# Altium schematic sheet Sh_Inputs_Analog.SchDoc
size A3
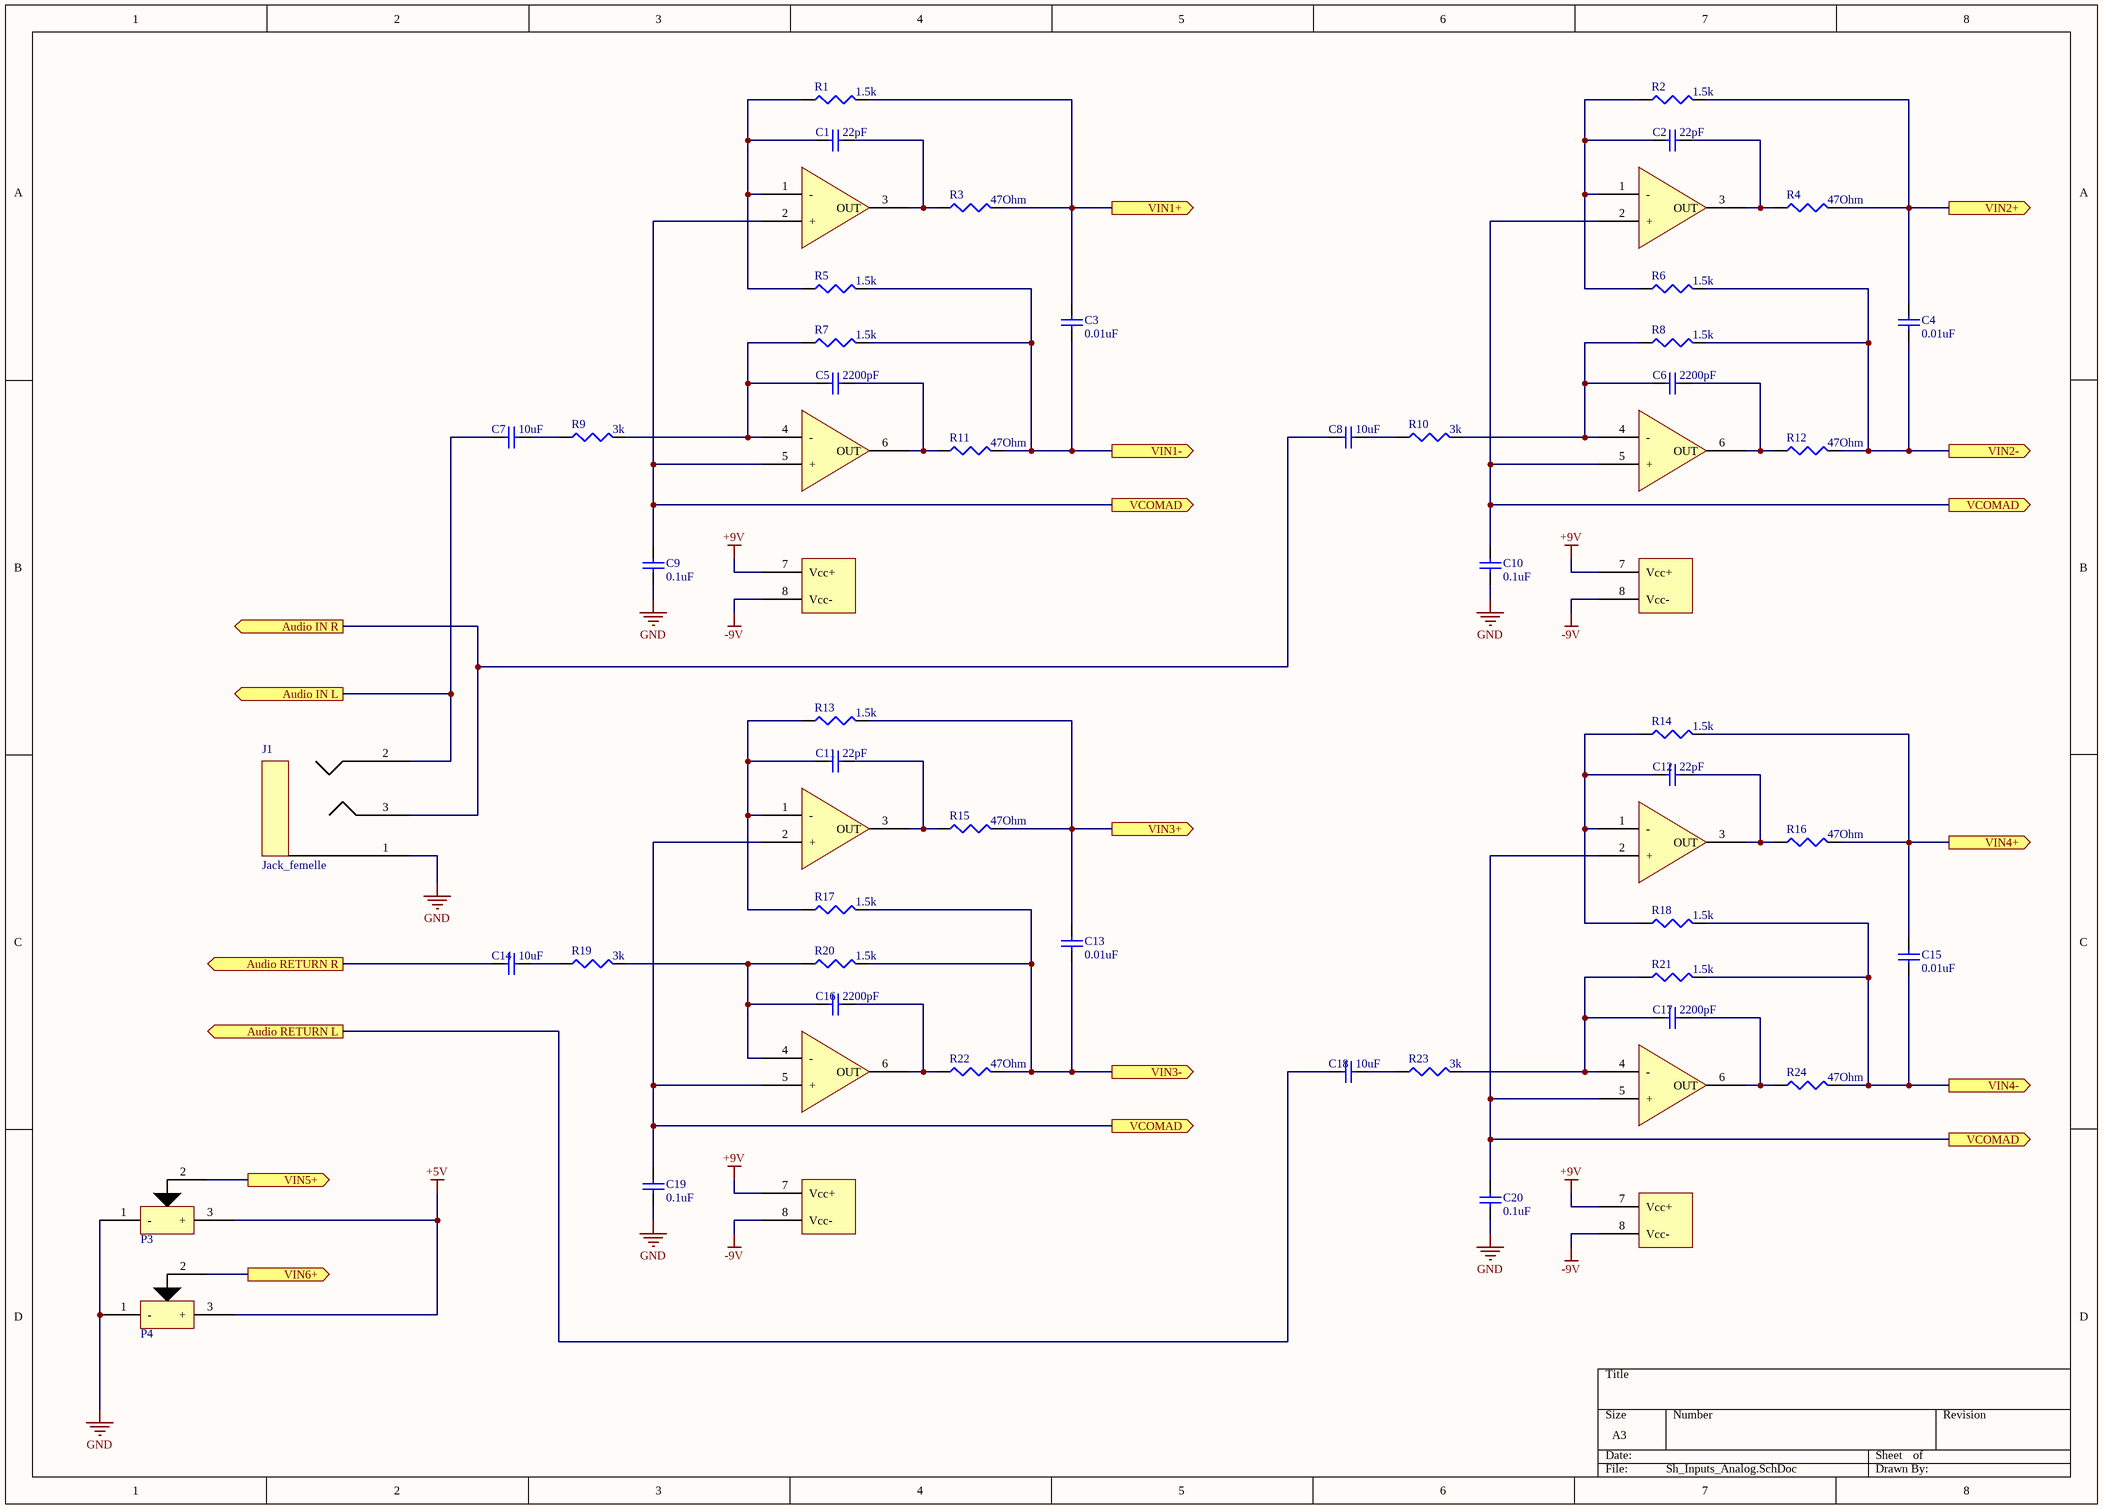
[diagram p0: Sh_Inputs_Analog.SchDoc]

## Parts
C1  value 22pF  [1608[0603]]  (hidden comment: Cap Semi)
C2  value 22pF  [1608[0603]]  (hidden comment: Cap Semi)
C3  value 0.01uF  [1608[0603]]  (hidden comment: Cap Semi)
C4  value 0.01uF  [1608[0603]]  (hidden comment: Cap Semi)
C5  value 2200pF  [1608[0603]]  (hidden comment: Cap Semi)
C6  value 2200pF  [1608[0603]]  (hidden comment: Cap Semi)
C7  value 10uF  [1608[0603]]  (hidden comment: Cap Semi)
C8  value 10uF  [1608[0603]]  (hidden comment: Cap Semi)
C9  value 0.1uF  [1608[0603]]  (hidden comment: Cap Semi)
C10  value 0.1uF  [1608[0603]]  (hidden comment: Cap Semi)
C11  value 22pF  [1608[0603]]  (hidden comment: Cap Semi)
C12  value 22pF  [1608[0603]]  (hidden comment: Cap Semi)
C13  value 0.01uF  [1608[0603]]  (hidden comment: Cap Semi)
C14  value 10uF  [1608[0603]]  (hidden comment: Cap Semi)
C15  value 0.01uF  [1608[0603]]  (hidden comment: Cap Semi)
C16  value 2200pF  [1608[0603]]  (hidden comment: Cap Semi)
C17  value 2200pF  [1608[0603]]  (hidden comment: Cap Semi)
C18  value 10uF  [1608[0603]]  (hidden comment: Cap Semi)
C19  value 0.1uF  [1608[0603]]  (hidden comment: Cap Semi)
C20  value 0.1uF  [1608[0603]]  (hidden comment: Cap Semi)
J1  Jack_femelle  [Jack_Femelle]
P3  Potentiomètre  [Trimmer]  (value not drawn)
P4  Potentiomètre  [Trimmer]  (value not drawn)
R1  value 1.5k  [J1-0603]  (hidden comment: Res3)
R2  value 1.5k  [J1-0603]  (hidden comment: Res3)
R3  value 47Ohm  [J1-0603]  (hidden comment: Res3)
R4  value 47Ohm  [J1-0603]  (hidden comment: Res3)
R5  value 1.5k  [J1-0603]  (hidden comment: Res3)
R6  value 1.5k  [J1-0603]  (hidden comment: Res3)
R7  value 1.5k  [J1-0603]  (hidden comment: Res3)
R8  value 1.5k  [J1-0603]  (hidden comment: Res3)
R9  value 3k  [J1-0603]  (hidden comment: Res3)
R10  value 3k  [J1-0603]  (hidden comment: Res3)
R11  value 47Ohm  [J1-0603]  (hidden comment: Res3)
R12  value 47Ohm  [J1-0603]  (hidden comment: Res3)
R13  value 1.5k  [J1-0603]  (hidden comment: Res3)
R14  value 1.5k  [J1-0603]  (hidden comment: Res3)
R15  value 47Ohm  [J1-0603]  (hidden comment: Res3)
R16  value 47Ohm  [J1-0603]  (hidden comment: Res3)
R17  value 1.5k  [J1-0603]  (hidden comment: Res3)
R18  value 1.5k  [J1-0603]  (hidden comment: Res3)
R19  value 3k  [J1-0603]  (hidden comment: Res3)
R20  value 1.5k  [J1-0603]  (hidden comment: Res3)
R21  value 1.5k  [J1-0603]  (hidden comment: Res3)
R22  value 47Ohm  [J1-0603]  (hidden comment: Res3)
R23  value 3k  [J1-0603]  (hidden comment: Res3)
R24  value 47Ohm  [J1-0603]  (hidden comment: Res3)
U2  Ampli_op  (value not drawn)
U3  Ampli_op  (value not drawn)
U4  Ampli_op  (value not drawn)
U5  Ampli_op  (value not drawn)

## Ports
Audio IN L (out), Audio IN R (out), Audio RETURN L (out), Audio RETURN R (out), VCOMAD (out), VIN1+ (out), VIN1- (out), VIN2+ (out), VIN2- (out), VIN3+ (out), VIN3- (out), VIN4+ (out), VIN4- (out), VIN5+ (out), VIN6+ (out)

## Nets
+5V: P3.3(+) P4.3(+)
+9V: U2.7(Vcc+) U3.7(Vcc+) U4.7(Vcc+) U5.7(Vcc+)
-9V: U2.8(Vcc-) U3.8(Vcc-) U4.8(Vcc-) U5.8(Vcc-)
GND: C9.2 C10.2 C19.2 C20.2 J1.1(GND) P3.1(-) P4.1(-)
Audio IN L: C7.2 J1.2(L) ; port Audio IN L
Audio IN R: C8.2 J1.3(R) ; port Audio IN R
Audio RETURN L: C18.2 ; port Audio RETURN L
Audio RETURN R: C14.2 ; port Audio RETURN R
VCOMAD: C9.1 C10.1 C19.1 C20.1 U2.2(+) U2.5(+) U3.2(+) U3.5(+) U4.2(+) U4.5(+) U5.2(+) U5.5(+) ; port VCOMAD
VIN1+: C3.1 R1.2 R3.2 ; port VIN1+
VIN1-: C3.2 R5.2 R7.2 R11.2 ; port VIN1-
VIN2+: C4.1 R2.2 R4.2 ; port VIN2+
VIN2-: C4.2 R6.2 R8.2 R12.2 ; port VIN2-
VIN3+: C13.1 R13.2 R15.2 ; port VIN3+
VIN3-: C13.2 R17.2 R20.2 R22.2 ; port VIN3-
VIN4+: C15.1 R14.2 R16.2 ; port VIN4+
VIN4-: C15.2 R18.2 R21.2 R24.2 ; port VIN4-
VIN5+: P3.2(RD) ; port VIN5+
VIN6+: P4.2(RD) ; port VIN6+
NetC1_1: C1.1 R3.1 U2.3(OUT)
NetC1_2: C1.2 R1.1 R5.1 U2.1(-)
NetC2_1: C2.1 R4.1 U3.3(OUT)
NetC2_2: C2.2 R2.1 R6.1 U3.1(-)
NetC5_1: C5.1 R11.1 U2.6(OUT)
NetC5_2: C5.2 R7.1 R9.2 U2.4(-)
NetC6_1: C6.1 R12.1 U3.6(OUT)
NetC6_2: C6.2 R8.1 R10.2 U3.4(-)
NetC7_1: C7.1 R9.1
NetC8_1: C8.1 R10.1
NetC11_1: C11.1 R15.1 U4.3(OUT)
NetC11_2: C11.2 R13.1 R17.1 U4.1(-)
NetC12_1: C12.1 R16.1 U5.3(OUT)
NetC12_2: C12.2 R14.1 R18.1 U5.1(-)
NetC14_1: C14.1 R19.1
NetC16_1: C16.1 R22.1 U4.6(OUT)
NetC16_2: C16.2 R19.2 R20.1 U4.4(-)
NetC17_1: C17.1 R24.1 U5.6(OUT)
NetC17_2: C17.2 R21.1 R23.2 U5.4(-)
NetC18_1: C18.1 R23.1

## Library data of the parts
C1-C20 = Cap Semi: Capacitor (Semiconductor SIM Model); Published: 8-Jun-2000; LatestRevisionDate: 29-May-2009; LatestRevisionNote: IPC-7351 Footprint Added.; PackageReference: C1206; Publisher: Altium Limited; PackageDescription: Chip Capacitor
R1-R24 = Res3: Resistor; Published: 8-Jun-2000; LatestRevisionDate: 29-May-2009; LatestRevisionNote: IPC-7351 Footprint Added.; PackageReference: J1-0603; Publisher: Altium Limited; PackageDescription: Chip Resistor